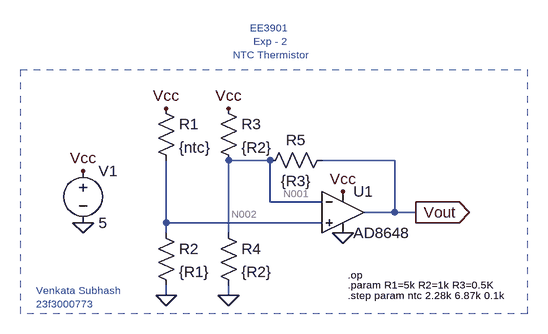
[diagram p0: schematic Exp2_NTC_Thermistor.asc]
Exp2_NTC_Thermistor.asc, the LTspice schematic file:
Version 4
SHEET 1 992 680
WIRE 464 176 400 176
WIRE 656 176 544 176
WIRE 464 240 464 176
WIRE 544 240 464 240
WIRE 656 256 656 176
WIRE 656 256 608 256
WIRE 688 256 656 256
WIRE 304 272 304 176
WIRE 544 272 304 272
WIRE 304 288 304 272
WIRE 400 288 400 176
WIRE 304 384 304 368
WIRE 400 384 400 368
FLAG 304 384 0
FLAG 576 288 0
FLAG 176 272 0
FLAG 176 192 Vcc
FLAG 304 96 Vcc
FLAG 400 96 Vcc
FLAG 576 224 Vcc
FLAG 400 384 0
FLAG 688 256 Vout
IOPIN 688 256 Out
SYMBOL Res 288 80 R0
SYMATTR InstName R1
SYMATTR Value {ntc}
SYMBOL Res 288 272 R0
SYMATTR InstName R2
SYMATTR Value {R1}
SYMBOL AD8648 576 192 R0
SYMATTR InstName U1
SYMBOL Res 384 80 R0
SYMATTR InstName R3
SYMATTR Value {R2}
SYMBOL Res 560 160 R90
WINDOW 0 0 56 VBottom 2
WINDOW 3 32 56 VTop 2
SYMATTR InstName R5
SYMATTR Value {R3}
SYMBOL Voltage 176 176 R0
SYMATTR InstName V1
SYMATTR Value 5
SYMBOL Res 384 272 R0
SYMATTR InstName R4
SYMATTR Value {R2}
TEXT 584 368 Left 1 !.param R1=5k R2=1k R3=0.5K
TEXT 584 384 Left 1 !.step param ntc 2.28k 6.87k 0.1k
TEXT 584 352 Left 1 !.op
TEXT 464 -8 Center 1 ;EE3901 \nExp - 2\nNTC Thermistor
TEXT 104 376 Left 1 ;Venkata Subhash \n23f3000773
RECTANGLE Normal 80 36 860 412 2

The netlist it stands for:
* Exp2_NTC_Thermistor.asc
R1 Vcc N002 {ntc}
R2 N002 0 {R1}
XU1 N002 N001 Vcc 0 Vout AD8648  ; pins In+ In- V+ V- OUT
R3 Vcc N001 {R2}
R5 Vout N001 {R3}
V1 Vcc 0 5
R4 N001 0 {R2}
.param R1=5k R2=1k R3=0.5K
.step param ntc 2.28k 6.87k 0.1k
.op
* EE3901
* Exp - 2
* NTC Thermistor
* Venkata Subhash
* 23f3000773
.lib ADI.lib
.backanno
.end

* Results of the author's LTspice run, read from the files saved beside the schematic
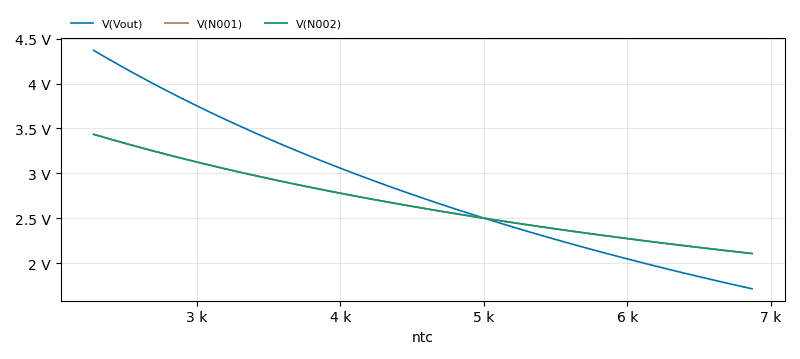
[diagram p1: Operating Point of Exp2_NTC_Thermistor.asc, plotted from the saved traces]
* Operating Point, 1 run:
*   V(Vout): 4.369 V at ntc=2.28 k, 1.713 V at ntc=6.87 k, min 1.713 V, max 4.369 V
*   V(N001): 3.435 V at ntc=2.28 k, 2.107 V at ntc=6.87 k, min 2.107 V, max 3.435 V
*   V(N002): 3.434 V at ntc=2.28 k, 2.106 V at ntc=6.87 k, min 2.106 V, max 3.434 V
* From the log:
*   Semiconductor Device Operating Points:
*                           --- Diodes ---
*   Name:    d:u1:1      d:u1:2      d:u1:3      d:u1:4      d:u1:fn
*   Model:    u1:dx       u1:dx       u1:dx       u1:dx     u1:dnoise
*   Id:      1.81e-12   -1.75e-12   -1.48e-12   -1.23e-12    1.00e-03
*   Vd:      1.33e-01   -1.74e+00   -1.48e+00   -1.22e+00    5.96e-01
*   Req:     1.50e+10    1.00e+12    1.00e+12    1.00e+12    2.59e+01
*   CAP:     0.00e+00    0.00e+00    0.00e+00    0.00e+00    0.00e+00
*   Name:   d:u1:fn2
*   Model:    u1:dy
*   Id:      1.00e-06
*   Vd:      5.96e-01
*   Req:     2.59e+04
*   CAP:     0.00e+00
*                           --- MOSFET Transistors ---
*   Name:        m:u1:1      m:u1:2      m:u1:3      m:u1:4      m:u1:5
*   Model:       u1:pix      u1:pix      u1:nix      u1:nix      u1:pox
*   Id:         -1.10e-04   -1.10e-04    1.10e-04    1.10e-04   -2.19e-03
*   Vgs:        -5.81e-01   -5.81e-01    5.82e-01    5.82e-01   -5.95e-01
*   Vds:        -3.82e+00   -3.82e+00    1.95e+00    1.95e+00   -6.31e-01
*   Vbs:         0.00e+00    0.00e+00    0.00e+00    0.00e+00    0.00e+00
*   Vth:        -5.00e-01   -5.00e-01    5.00e-01    5.00e-01   -3.28e-01
*   Vdsat:      -8.10e-02   -8.11e-02    8.18e-02    8.18e-02   -2.67e-01
*   Gm:          2.71e-03    2.71e-03    2.69e-03    2.69e-03    1.64e-02
*   Gds:         1.14e-06    1.14e-06    1.12e-06    1.12e-06    2.20e-05
*   Gmb:         0.00e+00    0.00e+00    0.00e+00    0.00e+00    0.00e+00
*   Cbd:         0.00e+00    0.00e+00    0.00e+00    0.00e+00    0.00e+00
*   Cbs:         0.00e+00    0.00e+00    0.00e+00    0.00e+00    0.00e+00
*   Cgsov:       0.00e+00    0.00e+00    0.00e+00    0.00e+00    0.00e+00
*   Cgdov:       0.00e+00    0.00e+00    0.00e+00    0.00e+00    0.00e+00
*   Cgbov:       0.00e+00    0.00e+00    0.00e+00    0.00e+00    0.00e+00
*   Cgs:         2.97e-12    2.97e-12    2.97e-12    2.97e-12    1.40e-12
*   Cgd:         0.00e+00    0.00e+00    0.00e+00    0.00e+00    0.00e+00
*   Cgb:         0.00e+00    0.00e+00    0.00e+00    0.00e+00    0.00e+00
*   Name:        m:u1:6
*   Model:       u1:nox
*   Id:          3.19e-04
*   Vgs:         4.29e-01
*   Vds:         4.37e+00
*   Vbs:         0.00e+00
*   Vth:         3.28e-01
*   Vdsat:       1.01e-01
*   Gm:          6.32e-03
*   Gds:         3.34e-06
*   Gmb:         0.00e+00
*   Cbd:         0.00e+00
*   Cbs:         0.00e+00
*   Cgsov:       0.00e+00
*   Cgdov:       0.00e+00
*   Cgbov:       0.00e+00
*   Cgs:         1.38e-12
*   Cgd:         0.00e+00
*   Cgb:         0.00e+00
*   Operating Bias Point Solution:
*   V(vcc)                           5   voltage
*   V(n002)                    3.43407   voltage
*   V(n001)                    3.43468   voltage
*   V(vout)                    4.36935   voltage
*   I(R1)                  0.000686813   device_current
*   I(R2)                  0.000686813   device_current
*   I(R3)                   0.00156532   device_current
*   I(R5)                   0.00186935   device_current
*   I(R4)                   0.00343468   device_current
*   I(V1)                  -0.00496268   device_current
*   Ix(u1:1)                   2.5e-11   subckt_current
*   Ix(u1:2)                  -2.5e-11   subckt_current
*   Ix(u1:99)               0.00271054   subckt_current
*   Ix(u1:50)             -0.000841188   subckt_current
*   Ix(u1:45)              -0.00186935   subckt_current